# Altium project cytron sheild.PrjPcb
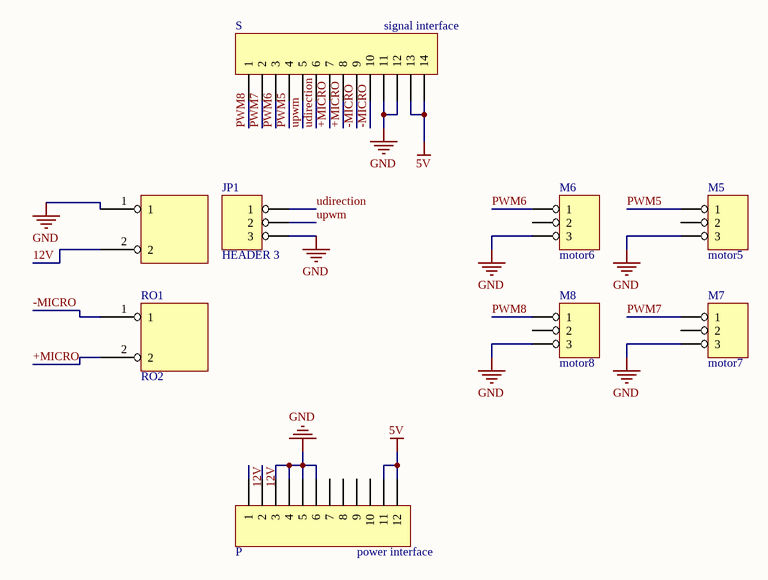
[diagram p0: cytron sheild.SchDoc]
1 sheet, 9 parts. Net scope: global (net labels, ports and power ports of the same name join across sheets).
Board file: cytron sheild.PcbDoc

## Sheet cytron sheild.SchDoc
size A4

### Parts
JP1  HEADER 3  [SIP3]
M5  motor5  [SIP3]
M6  motor6  [SIP3]
M7  motor7  [SIP3]
M8  motor8  [SIP3]
P  power interface  [HDR1X12]
RO1  Rossetta  [Rossetta 2-pin]  (value not drawn)
RO2  Rossetta  [Rossetta 2-pin]  (value not drawn)
S  signal interface  [HDR1X14]

### Nets
5V: P.11 P.12 S.13 S.14
GND: JP1.3 M5.3 M6.3 M7.3 M8.3 P.3 P.4 P.5 P.6 RO1.1 S.11 S.12
12V: P.1 P.2 RO1.2
+MICRO: RO2.2 S.7 S.8
-MICRO: RO2.1 S.9 S.10
PWM5: M5.1 S.4
PWM6: M6.1 S.3
PWM7: M7.1 S.2
PWM8: M8.1 S.1
udirection: JP1.1 S.6
upwm: JP1.2 S.5

Not connected (* = marked no-connect by the designer): M5 2; M6 2; M7 2; M8 2; P 7 8 9 10

### Library data of the parts
M5-M8 = HEADER 3
P = Header 12: Header, 12-Pin; LatestRevisionDate: 17-Jul-2002; LatestRevisionNote: Re-released for DXP Platform.; Publisher: Altium Limited
S = Header 14: Header, 14-Pin; LatestRevisionDate: 17-Jul-2002; LatestRevisionNote: Re-released for DXP Platform.; Publisher: Altium Limited